# Altium schematic sheet Voltage Regulators.SchDoc
size B; SheetNumber: 2; SheetTotal: 4
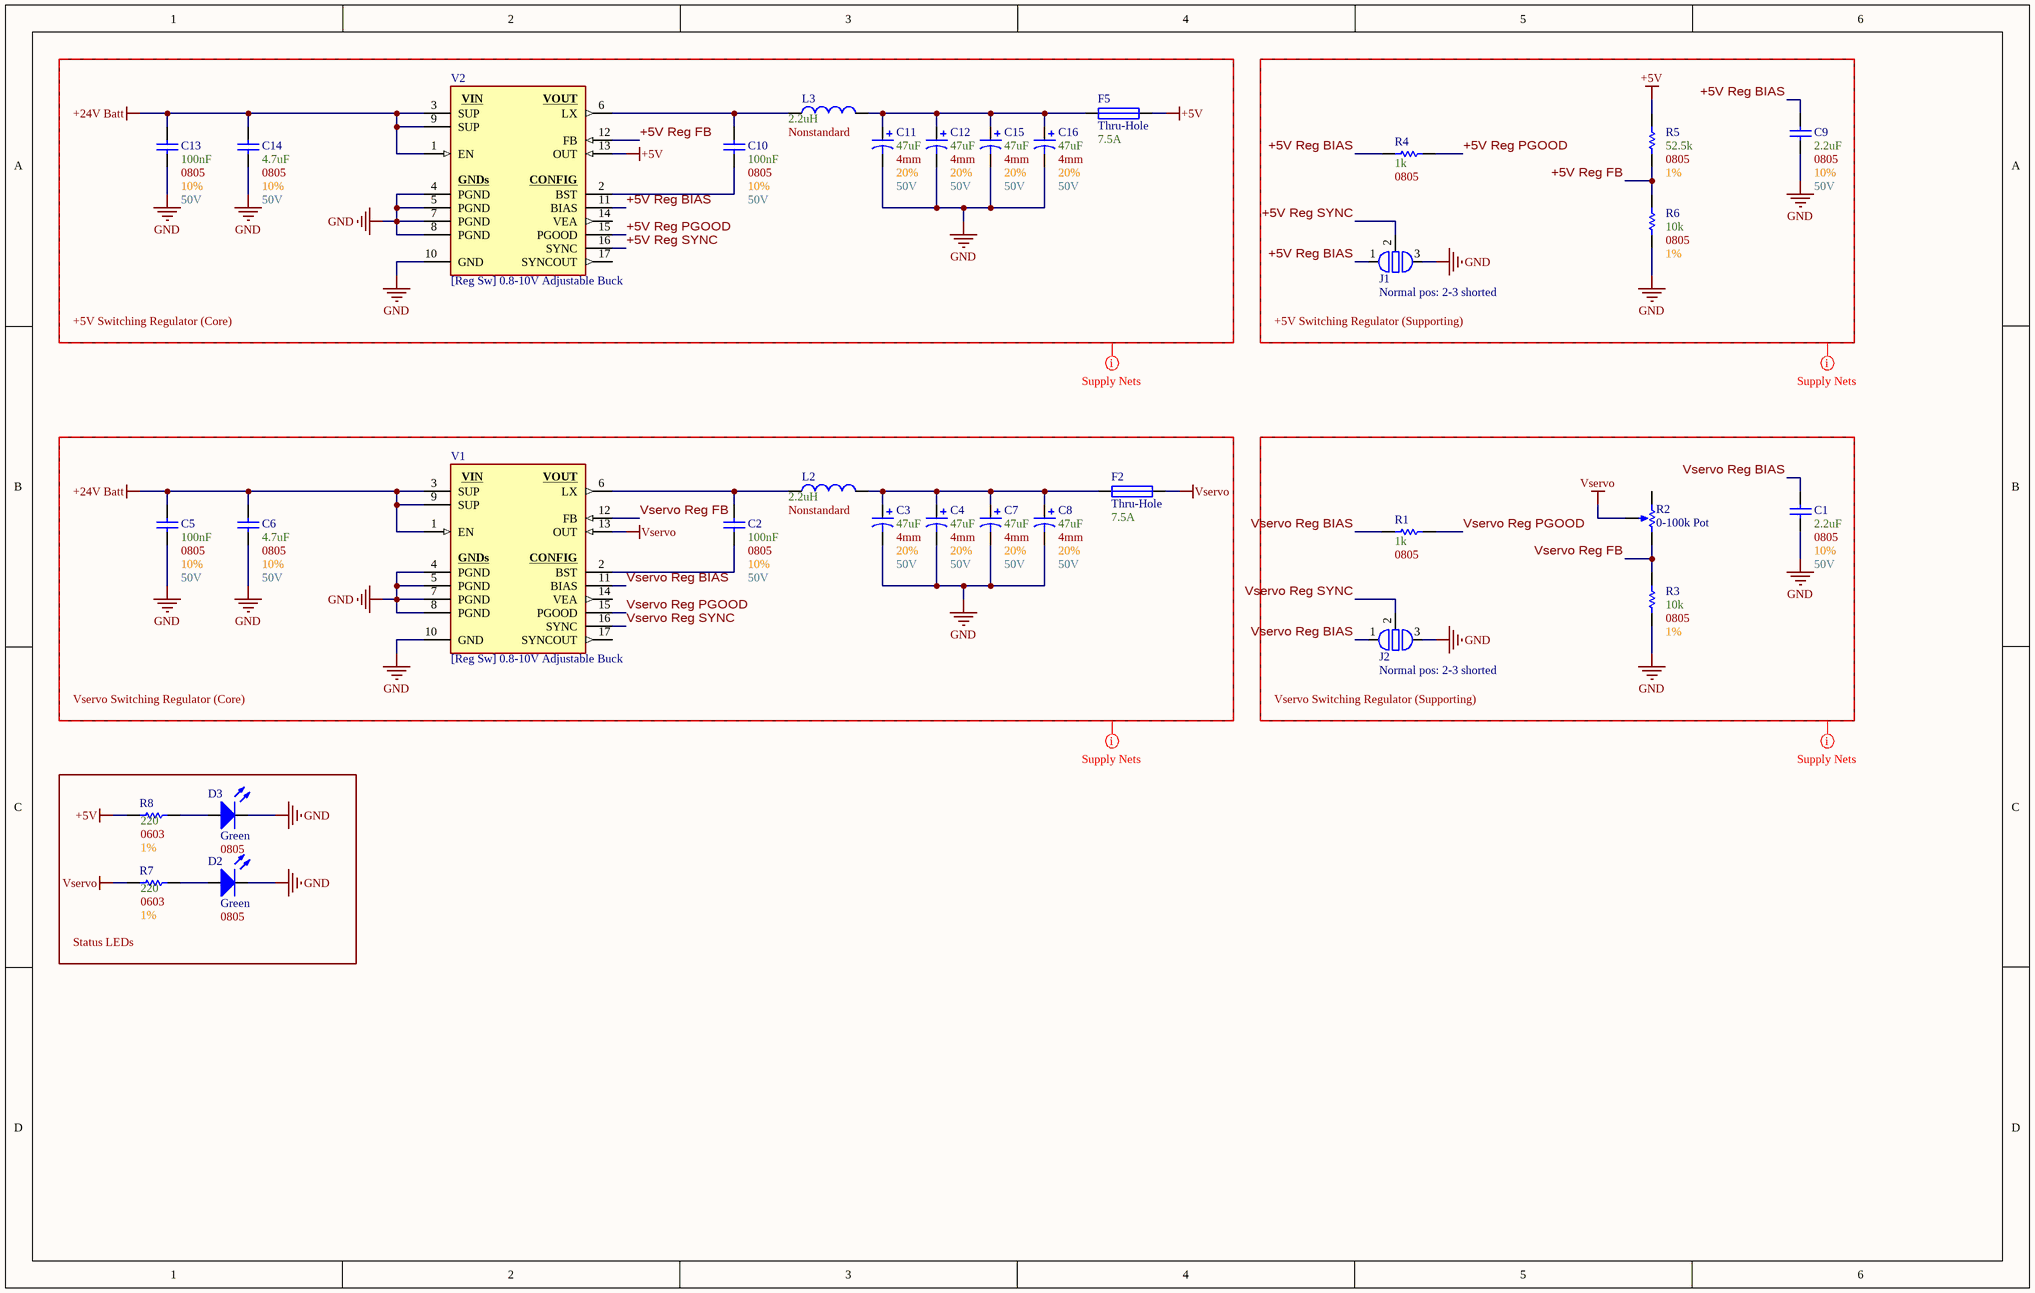
[diagram p0: Voltage Regulators.SchDoc]

## Parts
C1  Voltage: 50V  Tolerance: 10%  Size Package: 0805  Capacitance: 2.2uF  [[Cap] SMD 0805]  (hidden comment: SMD Nonpolarized)
C2  Voltage: 50V  Tolerance: 10%  Size Package: 0805  Capacitance: 100nF  [[Cap] SMD 0805]  (hidden comment: SMD Nonpolarized)
C3  Tolerance: 20%  Max Voltage: 50V  Capacitance: 47uF  Diameter: 4mm  [[Cap] SMD Polarized, 4mm]  (hidden comment: SMD Polarized)
C4  Tolerance: 20%  Max Voltage: 50V  Capacitance: 47uF  Diameter: 4mm  [[Cap] SMD Polarized, 4mm]  (hidden comment: SMD Polarized)
C5  Voltage: 50V  Tolerance: 10%  Size Package: 0805  Capacitance: 100nF  [[Cap] SMD 0805]  (hidden comment: SMD Nonpolarized)
C6  Voltage: 50V  Tolerance: 10%  Size Package: 0805  Capacitance: 4.7uF  [[Cap] SMD 0805]  (hidden comment: SMD Nonpolarized)
C7  Tolerance: 20%  Max Voltage: 50V  Capacitance: 47uF  Diameter: 4mm  [[Cap] SMD Polarized, 4mm]  (hidden comment: SMD Polarized)
C8  Tolerance: 20%  Max Voltage: 50V  Capacitance: 47uF  Diameter: 4mm  [[Cap] SMD Polarized, 4mm]  (hidden comment: SMD Polarized)
C9  Voltage: 50V  Tolerance: 10%  Size Package: 0805  Capacitance: 2.2uF  [[Cap] SMD 0805]  (hidden comment: SMD Nonpolarized)
C10  Voltage: 50V  Tolerance: 10%  Size Package: 0805  Capacitance: 100nF  [[Cap] SMD 0805]  (hidden comment: SMD Nonpolarized)
C11  Tolerance: 20%  Max Voltage: 50V  Capacitance: 47uF  Diameter: 4mm  [[Cap] SMD Polarized, 4mm]  (hidden comment: SMD Polarized)
C12  Tolerance: 20%  Max Voltage: 50V  Capacitance: 47uF  Diameter: 4mm  [[Cap] SMD Polarized, 4mm]  (hidden comment: SMD Polarized)
C13  Voltage: 50V  Tolerance: 10%  Size Package: 0805  Capacitance: 100nF  [[Cap] SMD 0805]  (hidden comment: SMD Nonpolarized)
C14  Voltage: 50V  Tolerance: 10%  Size Package: 0805  Capacitance: 4.7uF  [[Cap] SMD 0805]  (hidden comment: SMD Nonpolarized)
C15  Tolerance: 20%  Max Voltage: 50V  Capacitance: 47uF  Diameter: 4mm  [[Cap] SMD Polarized, 4mm]  (hidden comment: SMD Polarized)
C16  Tolerance: 20%  Max Voltage: 50V  Capacitance: 47uF  Diameter: 4mm  [[Cap] SMD Polarized, 4mm]  (hidden comment: SMD Polarized)
D2  Color: Green  Size Package: 0805  [[LED] SMD 0805]  (hidden comment: SMD LED)
D3  Color: Green  Size Package: 0805  [[LED] SMD 0805]  (hidden comment: SMD LED)
F2  Thru-Hole  Capacity: 7.5A  [[Fuse] Thru-Hole Blade]
F5  Thru-Hole  Capacity: 7.5A  [[Fuse] Thru-Hole Blade]
J1  Normal pos: 2-3 shorted  [[Jumper] Thru-Hole 3pin]
J2  Normal pos: 2-3 shorted  [[Jumper] Thru-Hole 3pin]
L2  Size Package: Nonstandard  Inductance: 2.2uH  [[Inductor] 7.4 X 6.6 X 3 MM]  (hidden comment: SMD Inductor)
L3  Size Package: Nonstandard  Inductance: 2.2uH  [[Inductor] 7.4 X 6.6 X 3 MM]  (hidden comment: SMD Inductor)
R1  Resistance: 1k  Size Package: 0805  [[Res] SMD 0805]  (hidden comment: [Res] SMD Resistor)
R2  0-100k Pot  [[Res] Pot 100k 0.5W]
R3  Tolerance: 1%  Resistance: 10k  Size Package: 0805  [[Res] SMD 0805]  (hidden comment: [Res] SMD Resistor)
R4  Resistance: 1k  Size Package: 0805  [[Res] SMD 0805]  (hidden comment: [Res] SMD Resistor)
R5  Tolerance: 1%  Resistance: 52.5k  Size Package: 0805  [[Res] SMD 0805]  (hidden comment: [Res] SMD Resistor)
R6  Tolerance: 1%  Resistance: 10k  Size Package: 0805  [[Res] SMD 0805]  (hidden comment: [Res] SMD Resistor)
R7  Resistance: 220  Size Package: 0603  Tolerance: 1%  [[Res] SMD 0603]  (hidden comment: [Res] SMD Resistor)
R8  Resistance: 220  Size Package: 0603  Tolerance: 1%  [[Res] SMD 0603]  (hidden comment: [Res] SMD Resistor)
V1  [Reg Sw] 0.8-10V Adjustable Buck  [[Reg] 0.8-10V Adjustable Buck]
V2  [Reg Sw] 0.8-10V Adjustable Buck  [[Reg] 0.8-10V Adjustable Buck]

## Blocks framed on the sheet
+5V Switching Regulator (Core): C10-C16 F5 L3 V2
+5V Switching Regulator (Supporting): C9 J1 R4-R6
Vservo Switching Regulator (Core): C2-C8 F2 L2 V1
Vservo Switching Regulator (Supporting): C1 J2 R1-R3
Status LEDs: D2 D3 R7 R8

## Nets
+5V: F5.2 R5.2 R8.2 V2.13(OUT)
+24V Batt: C5.2 C6.2 C13.2 C14.2 V1.1(EN) V1.3(SUP) V1.9(SUP) V2.1(EN) V2.3(SUP) V2.9(SUP)
GND: C1.1 C3.2 C4.2 C5.1 C6.1 C7.2 C8.2 C9.1 C11.2 C12.2 C13.1 C14.1 C15.2 C16.2 D2.2(Cathode) D3.2(Cathode) J1.3 J2.3 R3.1 R6.1 V1.4(PGND) V1.5(PGND) V1.7(PGND) V1.8(PGND) V1.10(GND) V2.4(PGND) V2.5(PGND) V2.7(PGND) V2.8(PGND) V2.10(GND)
Vservo: F2.2 R2.2(TAP) R7.2 V1.13(OUT)
+5V Reg BIAS: C9.2 J1.1 R4.1 V2.11(BIAS)
+5V Reg FB: R5.1 R6.2 V2.12(FB)
+5V Reg PGOOD: R4.2 V2.15(PGOOD)
+5V Reg SYNC: J1.2(Common) V2.16(SYNC)
Vservo Reg BIAS: C1.2 J2.1 R1.1 V1.11(BIAS)
Vservo Reg FB: R2.3(BOT) R3.2 V1.12(FB)
Vservo Reg PGOOD: R1.2 V1.15(PGOOD)
Vservo Reg SYNC: J2.2(Common) V1.16(SYNC)
NetC2_1: C2.1 V1.2(BST)
NetC2_2: C2.2 L2.1 V1.6(LX)
NetC3_1: C3.1 C4.1 C7.1 C8.1 F2.1 L2.2
NetC10_1: C10.1 V2.2(BST)
NetC10_2: C10.2 L3.1 V2.6(LX)
NetC11_1: C11.1 C12.1 C15.1 C16.1 F5.1 L3.2
NetD2_1: D2.1(Anode) R7.1
NetD3_1: D3.1(Anode) R8.1

Not connected (* = marked no-connect by the designer): R2 1(TOP); V1 14(VEA) 17(SYNCOUT); V2 14(VEA) 17(SYNCOUT)

## Layout directives
net class Supply_Nets: +5V, +5V Reg BIAS, +5V Reg FB, +5V Reg PGOOD, +5V Reg SYNC, +24V Batt, GND, Vservo, Vservo Reg BIAS, Vservo Reg FB, Vservo Reg PGOOD, Vservo Reg SYNC

## Notes on the sheet
- (in symbol [Reg Sw] 0.8-10V Adjustable Buck) VIN; VOUT; GNDs; CONFIG

## Library data of the parts
C1 C2 C5 C6 C9 C10 C13 C14 = [Cap] SMD Nonpolarized: Supplier 1: DigiKey
  C1 C9: Supplier Part Number 1: 587-3169-1-ND
  C2 C5 C10 C13: Supplier Part Number 1: 1276-1003-6-ND
  C6 C14: Supplier Part Number 1: 490-12394-1-ND
C3 C4 C7 C8 C11 C12 C15 C16 = [Cap] SMD Polarized: Supplier 1: DigiKey; Supplier Part Number 1: 10-EEE-FN1A470URCT-ND
D2 D3 = [LED] SMD: Generic; Part #: *; Supplier 1: DigiKey; Supplier Part Number 1: 475-LGR971-KN-1CT-ND
F2 F5 = [Fuse] Thru-Hole Blade: Mouser Part #: *; Supplier 1: DigiKey; Supplier Part Number 1: WK6265-ND
J1 J2 = [Jump] Thru-Hole 3pin: Clip Jumper; NO/NC: 2,3 NC
L2 L3 = [Inductor] SMD Inductor: JLC Part #: *; Mouser Part #: *; Supplier 1: DigiKey; Supplier Part Number 1: XC2402CT-ND
R1 R3-R8 = [Res] SMD Resistor: Generic; Supplier 1: DigiKey
  R1 R4: Supplier Part Number 1: RR12P1.0KDCT-ND
  R3 R6: Supplier Part Number 1: 311-10KARCT-ND
  R5: Supplier Part Number 1: 311-52.3KCRCT-ND
  R7 R8: Supplier Part Number 1: 311-220HRCT-ND
R2 = [Res] Pot 100k 0.5W: Supplier 1: DigiKey; Supplier Part Number 1: 3386P-104LF-ND
V1 V2 = [Reg Sw] 0.8-10V Adjustable Buck: MAX20408AFOF/VY+; Supplier 1: DigiKey; Supplier Part Number 1: 505-MAX20408AFOF/VY+-ND